# EasyEDA schematic SCH_Final-project_2026-05-26.json
TITLE: Final project Development of an AI-Based Autonomous Lawn Mower Control System; REV: 1.0; Date: 2025-10-29; Sheet: 1/1; Drawn By: MtT 67; Company: Kmutnb
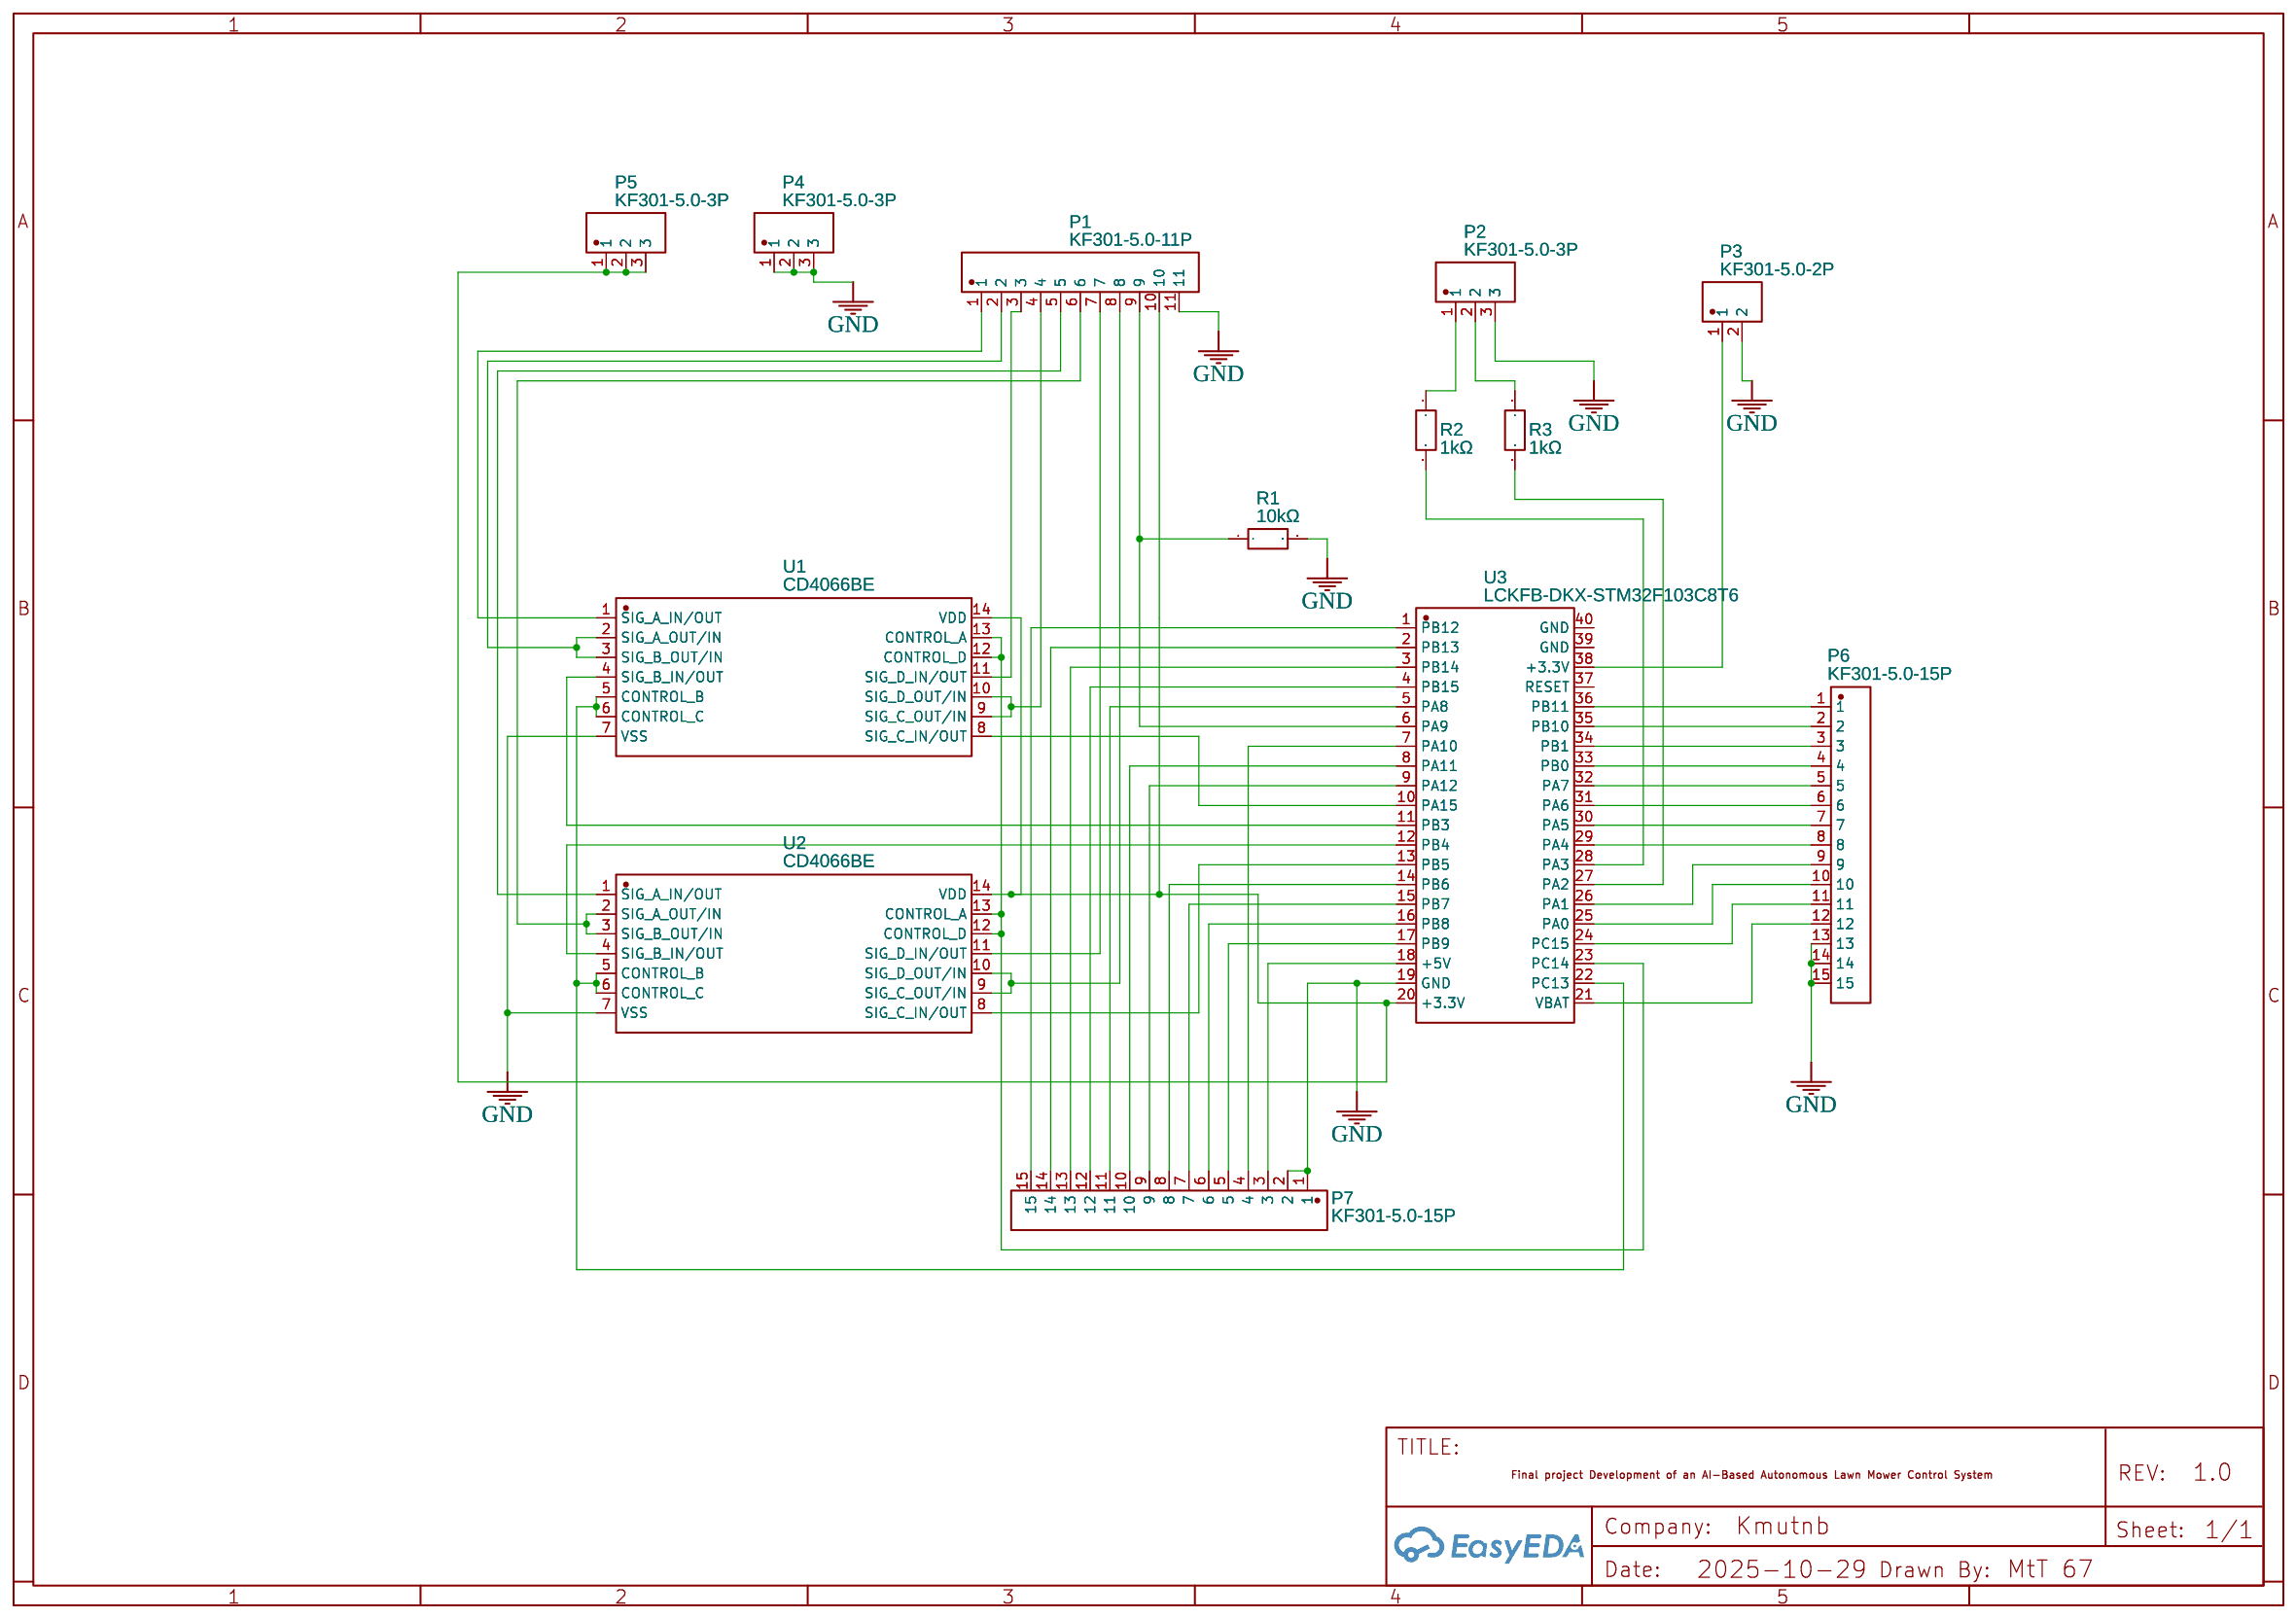
[diagram p0: schematic sheet]

## Parts
P1  KF301-5.0-11P  [CONN-TH_P5.00-11P_KF301-5.0]
P2  KF301-5.0-3P  [CONN-TH_3P-P5.00_KF301-5.0-3P]
P3  KF301-5.0-2P  [CONN-TH_P5.00_KF301-5.0-2P]
P4  KF301-5.0-3P  [CONN-TH_3P-P5.00_KF301-5.0-3P]
P5  KF301-5.0-3P  [CONN-TH_3P-P5.00_KF301-5.0-3P]
P6  KF301-5.0-15P  [CONN-TH_P5.00-15P_KF301-5.0]
P7  KF301-5.0-15P  [CONN-TH_P5.00-15P_KF301-5.0]
R1  10kΩ  [RES-TH_BD2.4-L6.3-P10.30-D0.6]
R2  1kΩ  [RES-TH_BD2.4-L6.3-P10.30-D0.6]
R3  1kΩ  [RES-TH_BD2.4-L6.3-P10.30-D0.6]
U1  CD4066BE  [DIP-14_L19.2-W6.6-P2.54-LS10.9-BL]
U2  CD4066BE  [DIP-14_L19.2-W6.6-P2.54-LS10.9-BL]
U3  LCKFB-DKX-STM32F103C8T6  [CONN-TH_L53.3-W22.9_STM32F103C8T6-CARD]

## Library data of the parts
P1 = KF301-5.0-11P: Contributor: LCSC; Supplier: LCSC; Supplier Part: C9900001101; Manufacturer: null; JLCPCB Part Class: Extended Part
P2 P4 P5 = KF301-5.0-3P: Contributor: LCSC; Supplier: LCSC; Supplier Part: C474882; Manufacturer: KEFA(科发); JLCPCB Part Class: Extended Part
P3 = KF301-5.0-2P: Contributor: LCSC; Supplier: LCSC; Supplier Part: C474881; Manufacturer: KEFA(科发); JLCPCB Part Class: Extended Part
P6 P7 = KF301-5.0-15P: Contributor: LCSC; Supplier: LCSC; Supplier Part: C9900001100; Manufacturer: null; JLCPCB Part Class: Extended Part
R1-R3 = RN 1/4W 10K F T/B A1: Contributor: LCSC; Supplier: LCSC; Supplier Part: C410695; Manufacturer: Tyohm(幸亚电阻); Manufacturer Part: RN1/4W10KFT/BA1; JLCPCB Part Class: Extended Part
U1 U2 = CD4066BE: sourceId: 8uoGAS9rJ; Supplier: LCSC; Manufacturer: TI(德州仪器); Supplier Part: C5203; JLCPCB Part Class: Extended Part
U3 = LCKFB-DKX-STM32F103C8T6: Supplier: LCSC; Supplier Part: C22396880; Manufacturer: 立创开发板; Contributor: lcsc; JLCPCB Part Class: Extended Part

## Nets
GND: P1.11 P2.3 P3.2 P4.1 P4.2 P4.3 P6.13 P6.14 P6.15 P7.1 P7.2 R1.2 U1.7(VSS) U2.7(VSS) U3.19(GND)
Net-(P1-1): P1.1 U1.1(SIG_A_IN/OUT)
Net-(P1-2): P1.2 U1.2(SIG_A_OUT/IN) U1.3(SIG_B_OUT/IN)
Net-(P1-3): P1.3 U1.11(SIG_D_IN/OUT)
Net-(P1-4): P1.4 U1.9(SIG_C_OUT/IN) U1.10(SIG_D_OUT/IN)
Net-(P1-5): P1.5 U2.1(SIG_A_IN/OUT)
Net-(P1-6): P1.6 U2.2(SIG_A_OUT/IN) U2.3(SIG_B_OUT/IN)
Net-(P1-7): P1.7 U2.11(SIG_D_IN/OUT)
Net-(P1-8): P1.8 U2.9(SIG_C_OUT/IN) U2.10(SIG_D_OUT/IN)
Net-(P1-9): P1.9 R1.1 U3.6(PA9)
Net-(P1-10): P1.10 P5.1 P5.2 P5.3 U1.14(VDD) U2.14(VDD) U3.20(+3.3V)
Net-(P2-1): P2.1 R2.1
Net-(P2-2): P2.2 R3.1
Net-(P3-1): P3.1 U3.38(+3.3V)
Net-(P6-1): P6.1 U3.36(PB11)
Net-(P6-2): P6.2 U3.35(PB10)
Net-(P6-3): P6.3 U3.34(PB1)
Net-(P6-4): P6.4 U3.33(PB0)
Net-(P6-5): P6.5 U3.32(PA7)
Net-(P6-6): P6.6 U3.31(PA6)
Net-(P6-7): P6.7 U3.30(PA5)
Net-(P6-8): P6.8 U3.29(PA4)
Net-(P6-9): P6.9 U3.26(PA1)
Net-(P6-10): P6.10 U3.25(PA0)
Net-(P6-11): P6.11 U3.24(PC15)
Net-(P6-12): P6.12 U3.21(VBAT)
Net-(P7-3): P7.3 U3.18(+5V)
Net-(P7-4): P7.4 U3.7(PA10)
Net-(P7-5): P7.5 U3.17(PB9)
Net-(P7-6): P7.6 U3.16(PB8)
Net-(P7-7): P7.7 U3.15(PB7)
Net-(P7-8): P7.8 U3.14(PB6)
Net-(P7-9): P7.9 U3.9(PA12)
Net-(P7-10): P7.10 U3.8(PA11)
Net-(P7-11): P7.11 U3.5(PA8)
Net-(P7-12): P7.12 U3.4(PB15)
Net-(P7-13): P7.13 U3.3(PB14)
Net-(P7-14): P7.14 U3.2(PB13)
Net-(P7-15): P7.15 U3.1(PB12)
Net-(R2-2): R2.2 U3.28(PA3)
Net-(R3-2): R3.2 U3.27(PA2)
Net-(U1-4): U1.4(SIG_B_IN/OUT) U3.11(PB3)
Net-(U1-5): U1.5(CONTROL_B) U1.6(CONTROL_C) U2.5(CONTROL_B) U2.6(CONTROL_C) U3.22(PC13)
Net-(U1-8): U1.8(SIG_C_IN/OUT) U3.10(PA15)
Net-(U1-12): U1.12(CONTROL_D) U1.13(CONTROL_A) U2.12(CONTROL_D) U2.13(CONTROL_A) U3.23(PC14)
Net-(U2-4): U2.4(SIG_B_IN/OUT) U3.12(PB4)
Net-(U2-8): U2.8(SIG_C_IN/OUT) U3.13(PB5)

Not connected (* = marked no-connect by the designer): U3 37(RESET) 39(GND) 40(GND)
